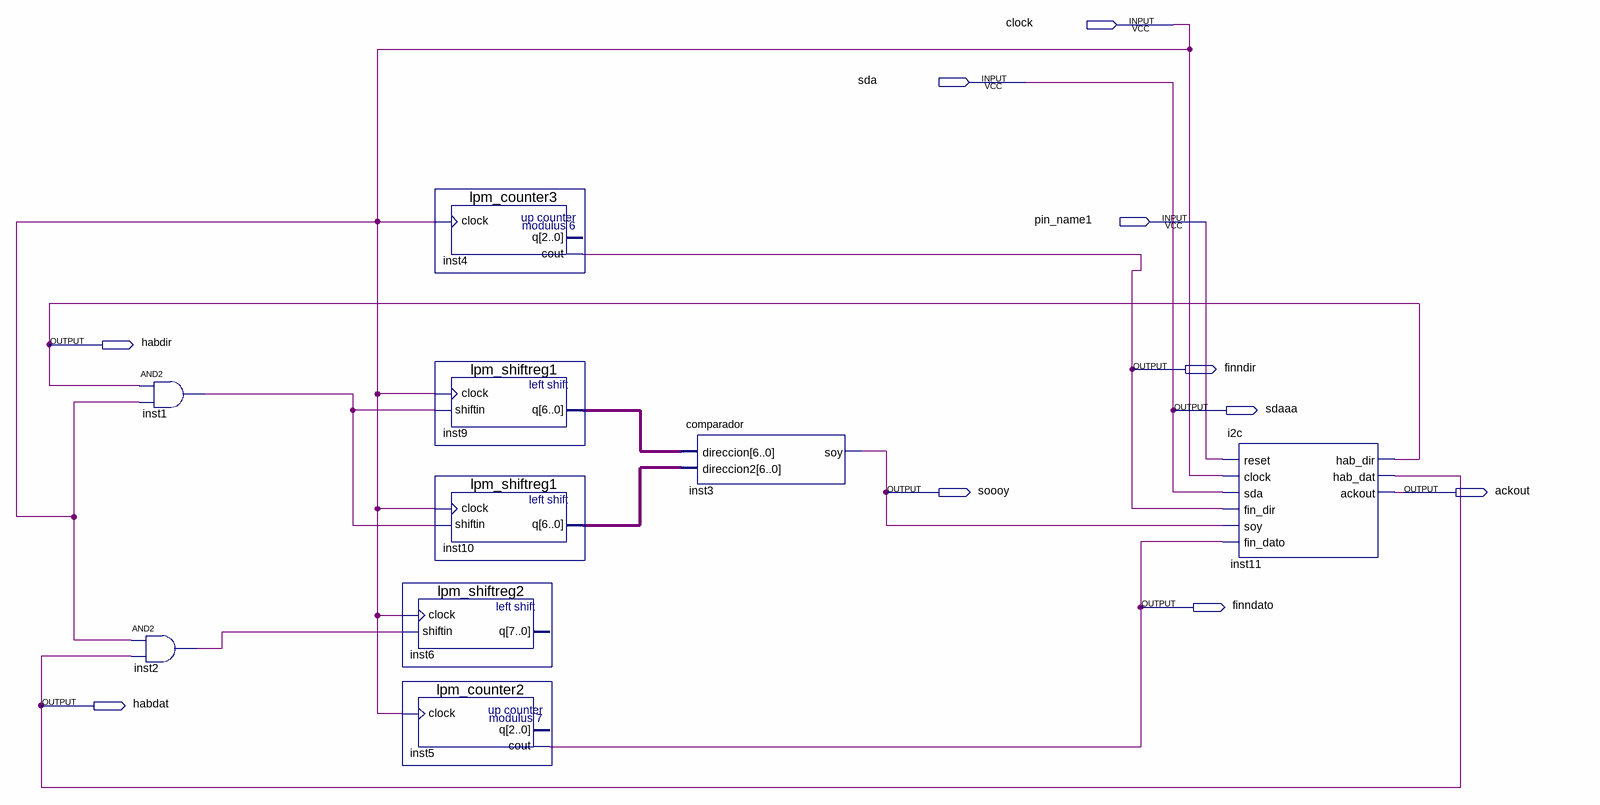
[diagram p0: schematic sheet]
// Quartus schematic circuitoi2c.bdf as structural Verilog: 9 symbols, 10 pins
module circuitoi2c (
  input  clock,
  input  sda,
  input  pin_name1,
  output habdir,
  output finndir,
  output sdaaa,
  output soooy,
  output ackout,
  output finndato,
  output habdat
);

  wire inst1_out, inst2_out;
  wire [6:0] inst9_q, inst10_q;

  and inst1 (inst1_out, habdir, clock);
  and inst2 (inst2_out, clock, habdat);
  lpm_shiftreg2 inst6 (.clock(clock), .shiftin(inst2_out));  // open: q
  lpm_counter2 inst5 (.clock(clock), .cout(finndato));  // open: q
  lpm_counter3 inst4 (.clock(clock), .cout(finndir));  // open: q
  lpm_shiftreg1 inst9 (.clock(clock), .shiftin(inst1_out), .q(inst9_q));
  lpm_shiftreg1 inst10 (.clock(clock), .shiftin(inst1_out), .q(inst10_q));
  comparador inst3 (.direccion(inst9_q), .direccion2(inst10_q), .soy(soooy));
  i2c inst11 (
    .reset(pin_name1), .clock(clock), .sda(sda), .fin_dir(finndir), .soy(soooy), .fin_dato(finndato),
    .hab_dir(habdir), .hab_dat(habdat), .ackout(ackout));

  assign sdaaa = sda;
endmodule
